# EAGLE design v1 (EAGLE 9.6.2)
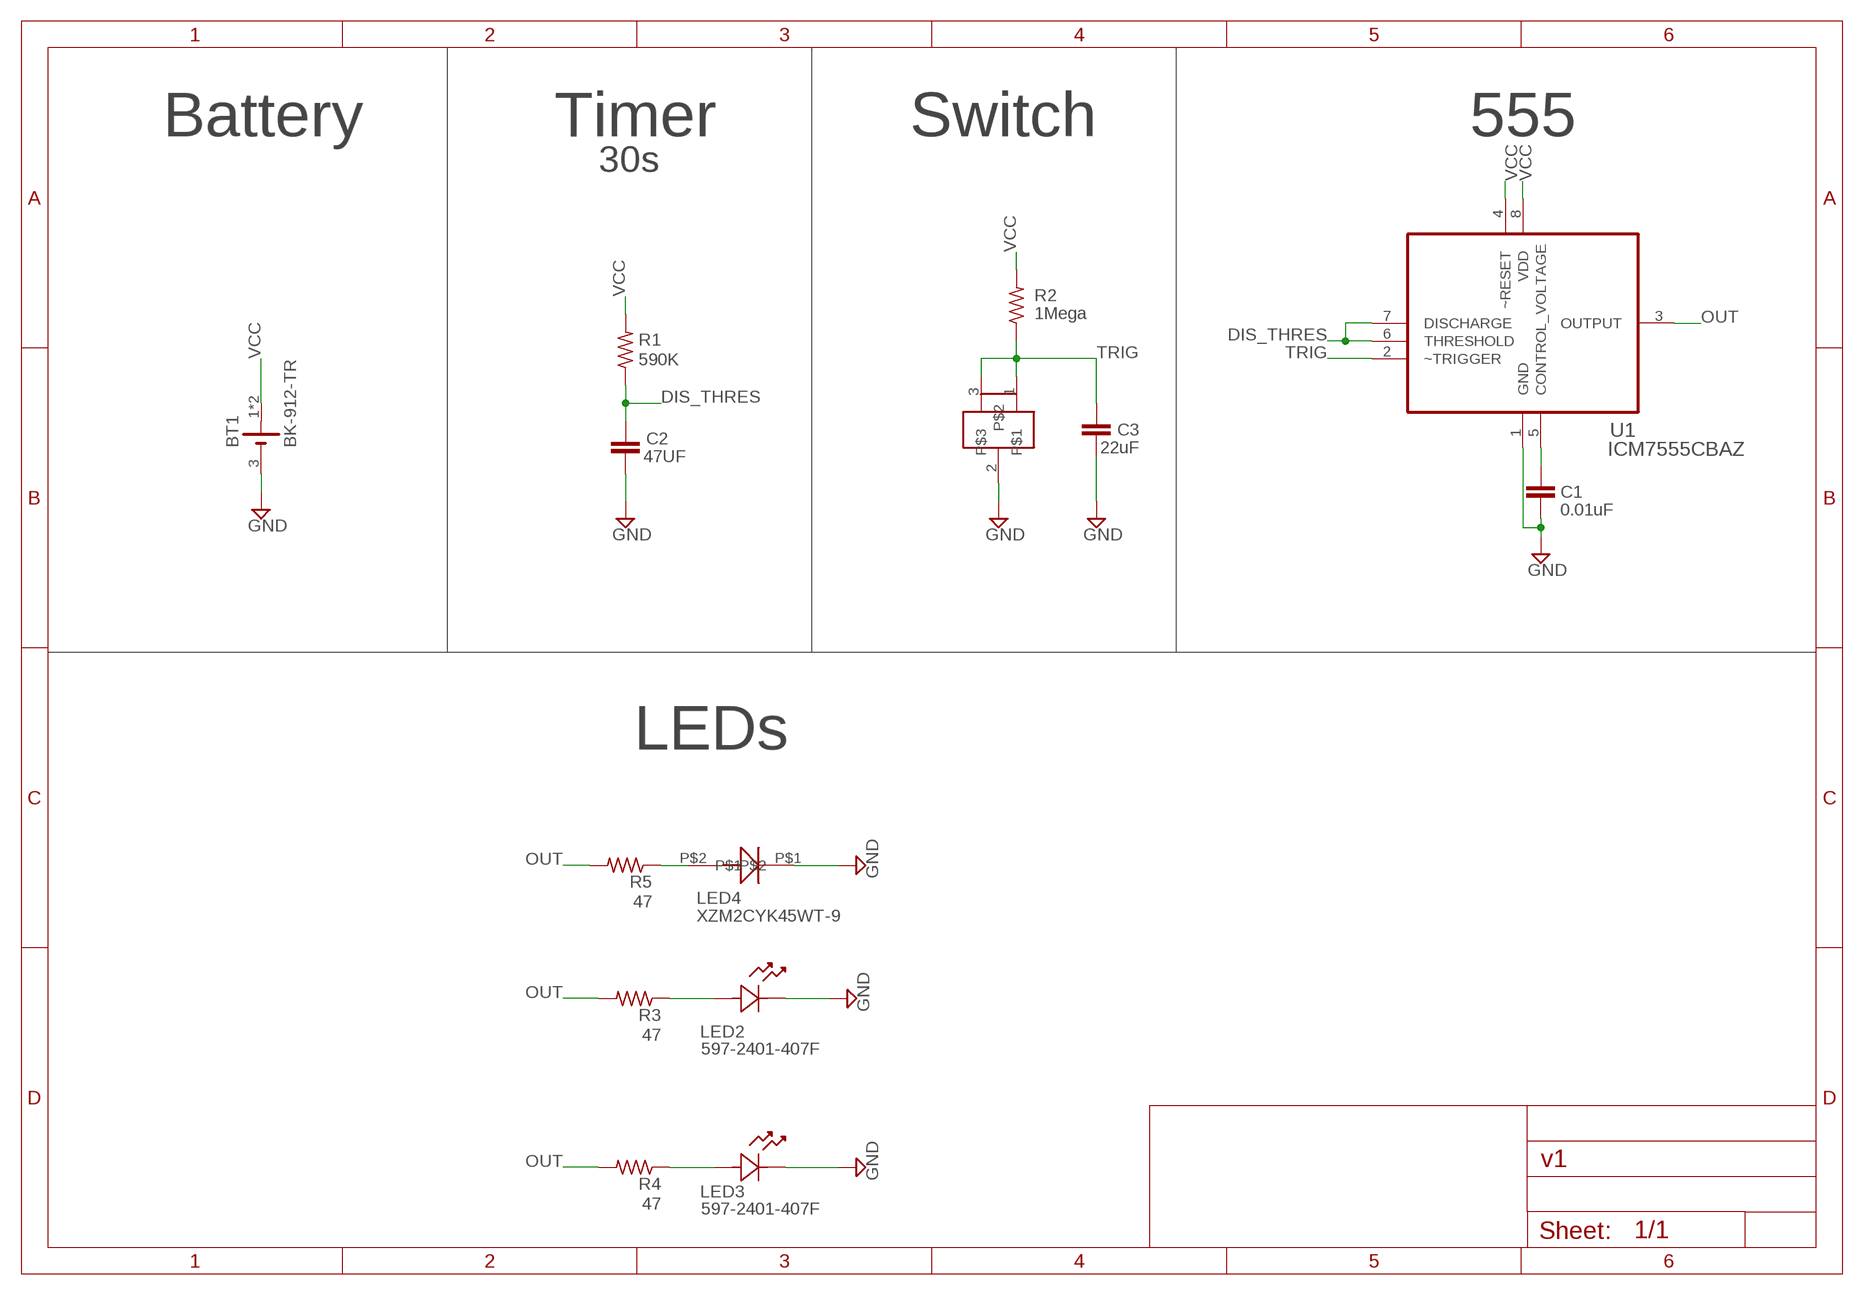
[diagram p0: schematic, sheet 1]

## Parts
BT1  BK-912-TR  [MPD_BK-912-TR]
C1  0.01uF  C-EUC0603  [C0603]
C2  47UF  C-EUC0603  [C0603]
C3  22uF  C-EUC0603  [C0603]
LED2  597-2401-407F  [LED_597-2401-407F]
LED3  597-2401-407F  [LED_597-2401-407F]
LED4  XZM2CYK45WT-9  [XZM2CYK45WT]
R1  590K  R-US_R0603  [R0603]
R2  1Mega  R-US_R0603  [R0603]
R3  47  R-US_R0603  [R0603]
R4  47  R-US_R0603  [R0603]
R5  47  R-US_R0603  [R0603]
SW1  TM1000Q  [SIP750W46P254L1400H1010Q3]
U1  ICM7555CBAZ  [SOIC127P600X175-8N]

## Nets
DIS_THRES: C2.2 R1.1 U1.6(THRESHOLD) U1.7(DISCHARGE)
GND: BT1.3(-) C1.1 C2.1 C3.1 LED2.1 LED3.1 LED4.P$1 SW1.2 U1.1(GND)
N$1: C1.2 U1.5(CONTROL_VOLTAGE)
N$2: LED2.2 R3.1
N$3: LED3.2 R4.1
N$4: LED4.P$2 R5.1
OUT: R3.2 R4.2 R5.2 U1.3(OUTPUT)
TRIG: C3.2 R2.1 SW1.1 SW1.3 U1.2(~TRIGGER)
VCC: BT1.1(+) BT1.2(+) R1.2 R2.2 U1.4(~RESET) U1.8(VDD)

## Notes on the sheet
- Battery | Timer | Switch | 555
- 30s
- LEDs

## Library data of the parts
BT1 = BK-912-TR:BK-912-TR: Holder Coin Cell 20mm Smd Check availability <https://pricing.snapeda.com/parts/BK-912-TR/MPD%20%28Memory/view-part?ref=eda>; AVAILABILITY: In Stock; DESCRIPTION: Battery Retainer Coin, 20.0mm 1 Cell SMD (SMT) Tab; DK_PN: BK-912-TR-ND; MF: MPD (Memory; MP: BK-912-TR; PACKAGE: None; PRICE: None; PURCHASE-URL: https://pricing.snapeda.com/search/part/BK-912-TR/?ref=eda
C1 = rcl:C-EU: CAPACITOR, European symbol; DK_PN: 1292-1384-1-ND; SPICEPREFIX: C
C2 = rcl:C-EU: CAPACITOR, European symbol; DK_PN: 1276-CL10A476MQ8QRNCCT-ND; SPICEPREFIX: C
C3 = rcl:C-EU: CAPACITOR, European symbol; DK_PN: 1276-2868-1-ND; MF: Samsung; MP: CL10A226MQ8NRNE; SPICEPREFIX: C
LED2 LED3 = 597-2401-407F:597-2401-407F: LED RIGHT ANGLE Yellow SMD 1208 Check availability <https://pricing.snapeda.com/parts/597-2401-407F/Dialight/view-part?ref=eda>; AVAILABILITY: In Stock; DESCRIPTION: Yellow - LED Indication - Discrete 2.2V 2-SMD, No Lead; DK_PN: 350-2944-1-ND; MF: Dialight; MP: 597-2401-407F; PACKAGE: SMD-2 Dialight; PRICE: None; PURCHASE-URL: https://pricing.snapeda.com/search/part/597-2401-407F/?ref=eda
LED4 = XZM2CYK45WT:XZM2CYK45WT-9: XZM2CYK45WT SunLED Reverse Mount - Datasheet <https://www.sunledusa.com/products/spec/XZM2CYK45WT-9.pdf>; DK_PN: 1497-1335-2-ND
R1 = rcl:R-US_: RESISTOR, American symbol; DK_PN: 311-590KHRCT-ND; SPICEPREFIX: R
R2 = rcl:R-US_: RESISTOR, American symbol; DK_PN: RMCF0603FG1M00CT-ND; SPICEPREFIX: R
R3-R5 = rcl:R-US_: RESISTOR, American symbol; DK_PN: 311-47.0HRCT-ND; MF: YAGEO; PN: RC0603FR-0747RL; SPICEPREFIX: R
SW1 = SIP750W46P254L1400H1010Q3:TM1000Q: TM1000 - Datasheet <https://sten-eswitch-13110800-production.s3.amazonaws.com/system/asset/product_line/data_sheet/128/TM1000.pdf>; DK_PN: EG4917CT-ND
U1 = ICM7555CBAZ:ICM7555CBAZ: CMOS RC timers Check availability <https://pricing.snapeda.com/parts/ICM7555CBAZ/Renesas%20Electronics/view-part?ref=eda>; AVAILABILITY: In Stock; DESCRIPTION: 555 Type, Timer/Oscillator (Single) IC 1MHz 8-SOIC; DK_PN: ICM7555CBAZ-ND; MF: Renesas Electronics; MP: ICM7555CBAZ; PACKAGE: SOIC-8 Intersil; PRICE: None; PURCHASE-URL: https://pricing.snapeda.com/search/part/ICM7555CBAZ/?ref=eda

## Board
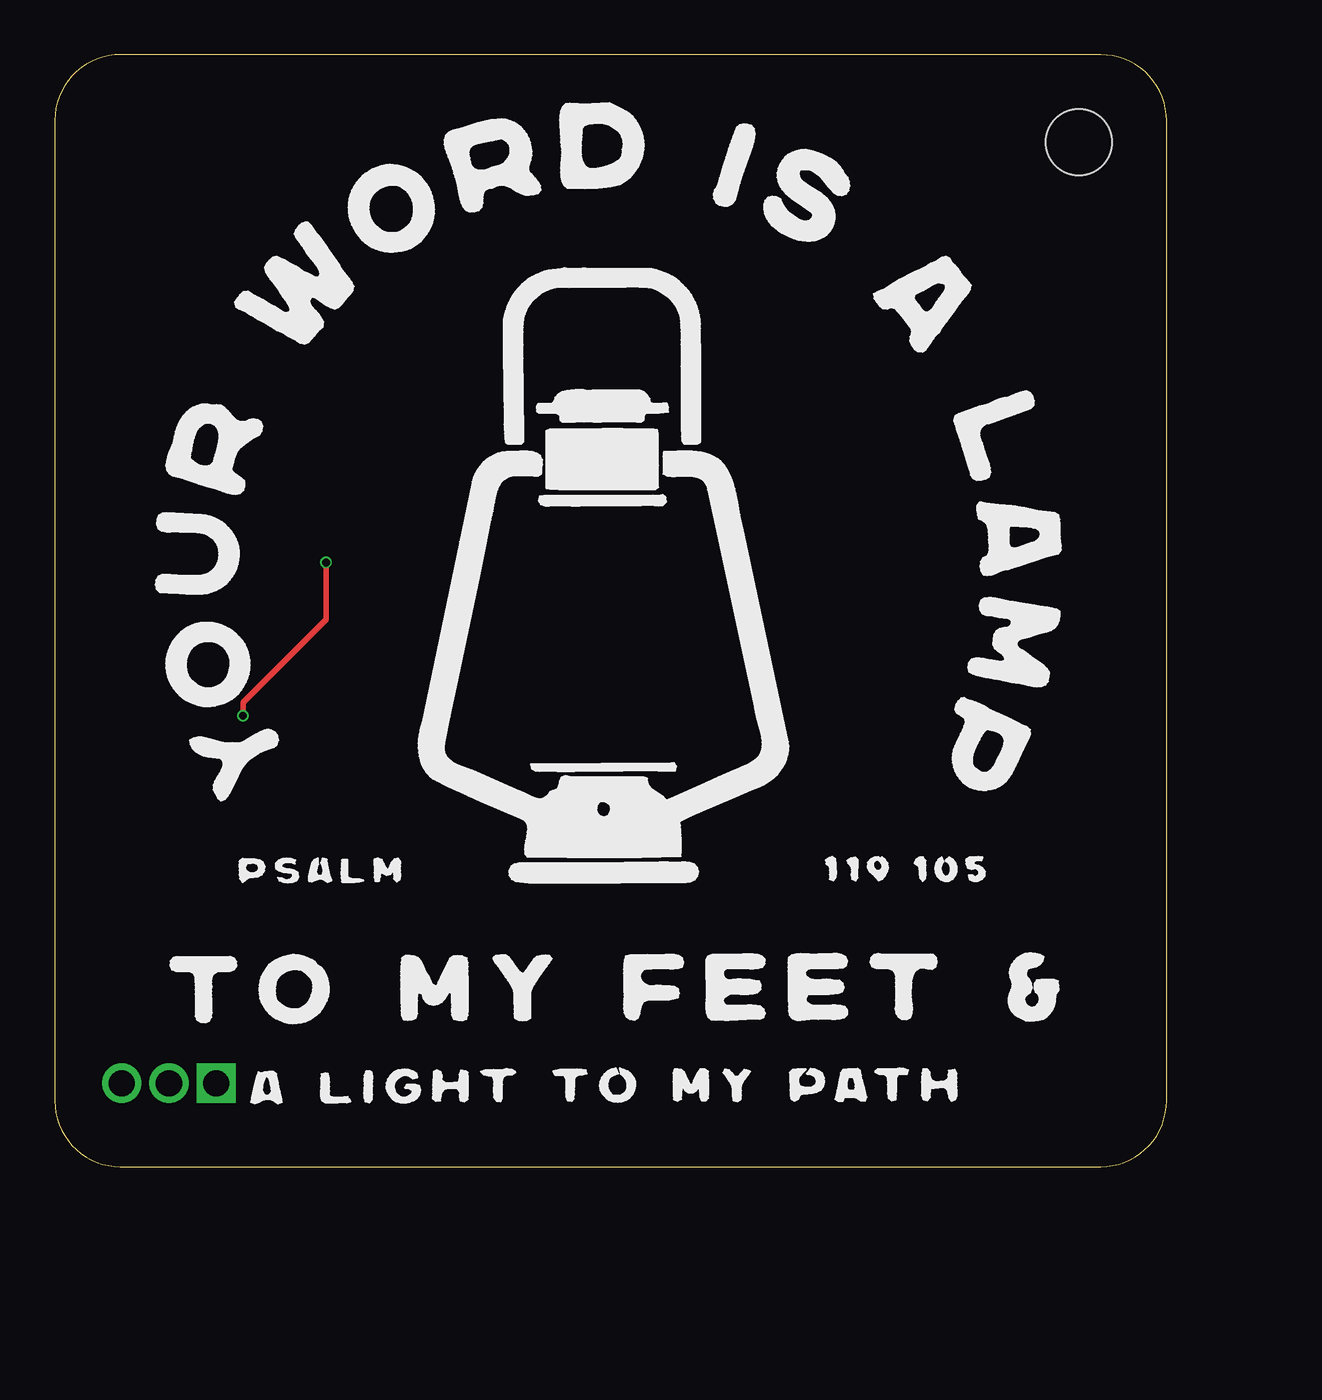
[diagram p1: board, top side]
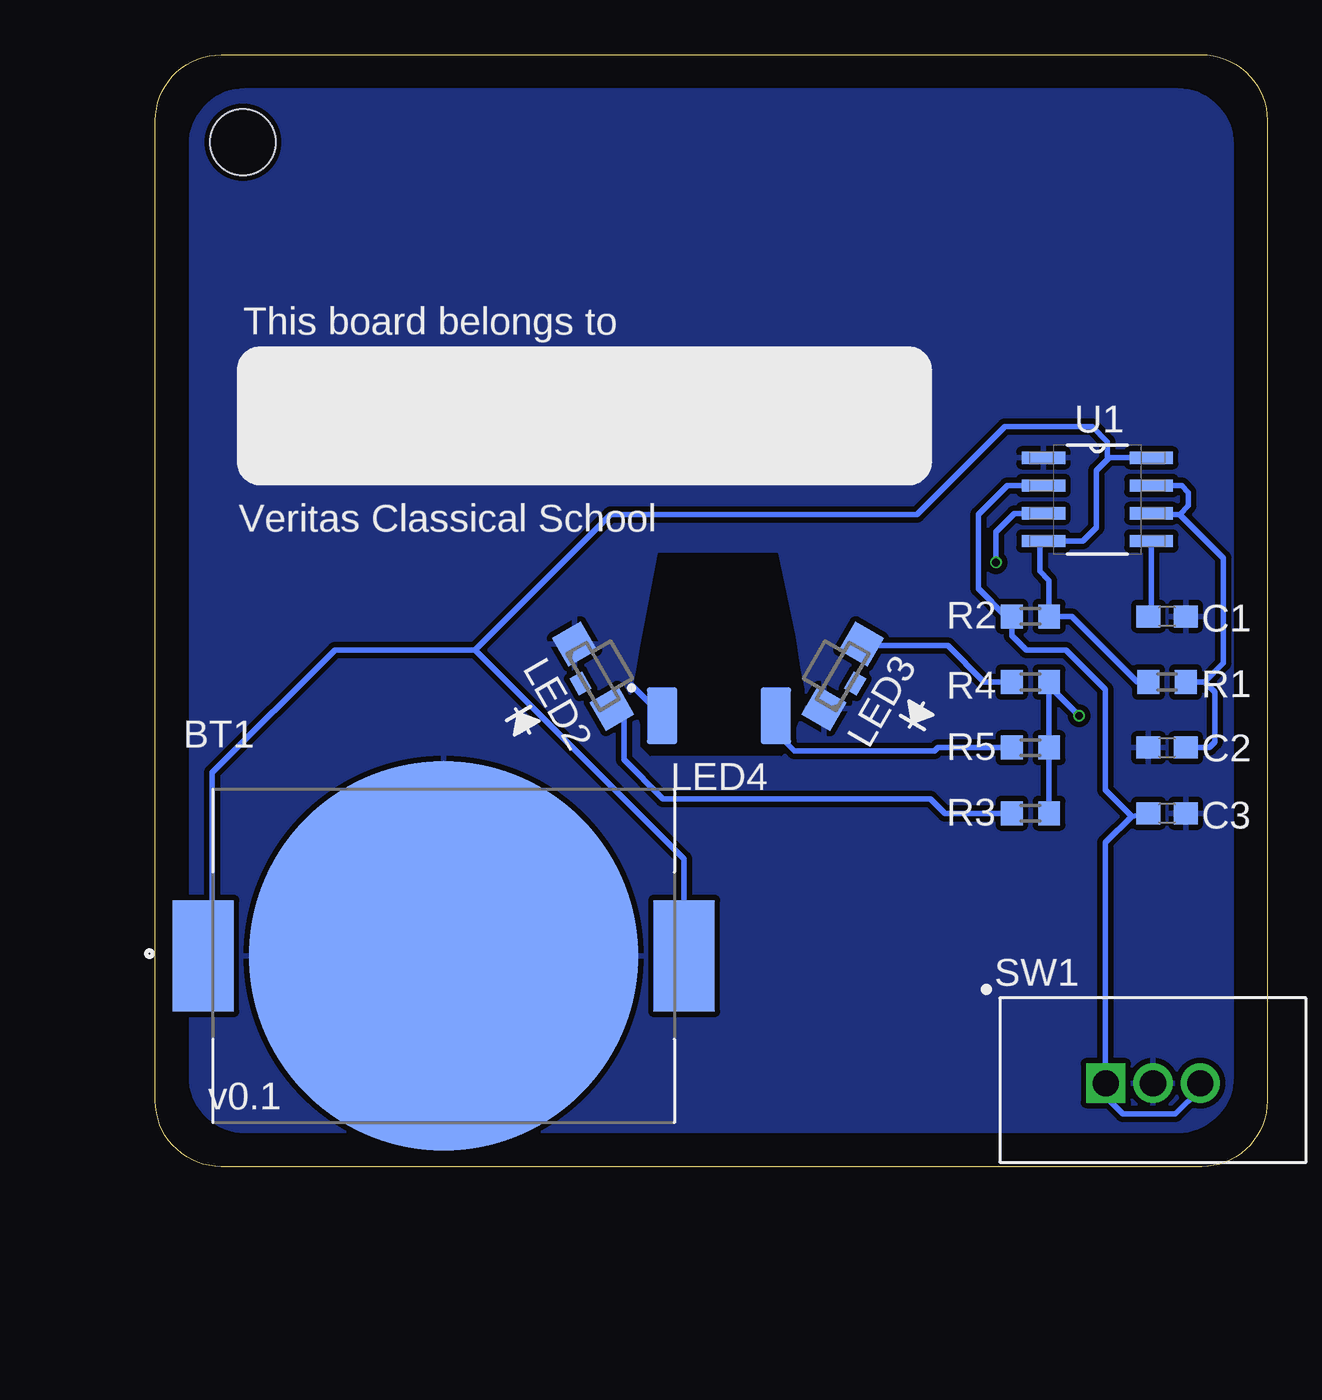
[diagram p2: board, bottom side, seen from below]

Size 50.8 x 50.8 mm. Coordinates in mm from the lower left corner, seen from the top.
Outline: 0,47.8 0,3 arc90 3,0 47.8,0 48.06,0.01 arc85 50.8,3 50.8,47.8 50.79,48.06 arc85 47.8,50.8 3,50.8 2.74,50.79 arc85 0,47.8
Copper layers (1*16): Top 0.035559375mm / dielectric 1.6mm / Bottom 0.035559375mm
Design rules "jlcpcb2layer": minimum track width 5mil, minimum drill 12mil, track to track 5mil, track to pad 5mil, pad to pad 5mil, via to via 5mil, smd to smd 5mil, copper to edge 8mil, drill to drill 6mil, minimum pad ring 5mil, minimum via ring 3mil, stop-mask expansion 2.5mil, vias tented up to drill 0mil, thermal gap 10mil
Holes 3 mm at 46.8,46.8

### Footprints (pad centres in the part's own frame; a part is rotated, then mirrored left to right if it is on the bottom)
MPD_BK-912-TR = smd 2.79 x 5.08: 1 -10.985,0; 2 10.985,0 | smd 17.78 x 17.78: 3 0,0
C0603 = smd 1.1 x 1: 1 -0.85,0; 2 0.85,0
LED_597-2401-407F = smd 1.499 x 1.499: 1 0,1.702; 2 0,-1.702 | smd 0.66 x 0.889: 3 -0.66,0
XZM2CYK45WT = smd 1.4 x 2.6: P$1 -2.6,0; P$2 2.6,0
R0603 = smd 1 x 1.1: 1 -0.85,0; 2 0.85,0
SIP750W46P254L1400H1010Q3 = drill 1.194 square: 1 0.381,0 | drill 1.194: 2 2.54,0; 3 4.699,0
SOIC127P600X175-8N = smd 1.981 x 0.559: 1 -2.464,1.905; 2 -2.464,0.635; 3 -2.464,-0.635; 4 -2.464,-1.905; 5 2.464,-1.905; 6 2.464,-0.635; 7 2.464,0.635; 8 2.464,1.905

### Placement (x,y rotation side)
BT1  37.63,9.63 0 bottom
C1  4.58,25.14 180 bottom
C2  4.58,19.14 0 bottom
C3  4.58,16.14 180 bottom
LED2  30.8,22.4 30 bottom
LED3  19.4,22.4 150 bottom
LED4  25.05,20.6 0 bottom
R1  4.58,22.14 180 bottom
R2  10.82,25.14 0 bottom
R3  10.82,16.14 0 bottom
R4  10.82,22.14 0 bottom
R5  10.82,19.14 0 bottom
SW1  7.76,3.81 0 bottom
U1  7.76,30.48 0 bottom

### Tracks (layer width: path | path; a pad name or v marks a point on that pad's centre or on a via)
DIS_THRES
  Bottom 0.254: U1.7 3.92,31.11 3.6,30.8 3.6,30.2 4,29.8 | 4,29.8 5.25,29.8 U1.6 | 4,29.8 2,27.8 2,23 2.86,22.14 | R1.1 2.86,22.14 | C2.2 2.66,19.14 2.4,19.4 2.4,21.68 2.86,22.14
GND
  Bottom 0.254: LED4.P$1 29.05,22
  pour Bottom (isolate 0.254, rank 2): 1.6,46.7 1.6,4.1 arc90 4.1,1.6 46.7,1.6 arc90 49.2,4.1 49.2,46.7 arc90 46.7,49.2 4.1,49.2 arc90
N$1
  Bottom 0.254: U1.5 5.3,25.27 C1.2
N$2
  Bottom 0.254: LED2.2 29.4,20.38 29.4,18.6 27.6,16.8 15.4,16.8 14.74,16.14 R3.1
N$3
  Bottom 0.254: LED3.2 18.15,23.8 14.6,23.8 12.94,22.14 R4.1
N$4
  Bottom 0.254: LED4.P$2 22.45,19.85 21.6,19 15.2,19 15.06,19.14 R5.1
N$5
  cutout Bottom: 22.4,28 21.6,24.2 21.4,22.8 21.2,21.8 21.2,21 21.6,20 21.6,19.4 22.2,18.8 28.2,18.8 28.6,19.2 28.6,20.2 28.8,20.8 29,21.6 28.8,22.6 28.6,23.8 27.8,28
OUT  (via drill 0.35)
  Top 0.254: v12.4,27.6 12.4,25 8.6,21.2 v8.6,20.6
  Bottom 0.254: U1.3 11.55,29.84 12.4,29 v12.4,27.6 | R3.2 R5.2 R4.2 10.14,22.14 v8.6,20.6
TRIG
  Bottom 0.254: U1.2 11.88,31.11 13.2,29.8 13.2,26.4 11.94,25.14 R2.1 11.67,24.27 11,23.6 9.2,23.6 7.4,21.8 7.4,17.2 6.2,16 | 7.4,3.83 SW1.1 | SW1.3 3.06,3.54 4.2,2.4 6.6,2.4 7.4,3.2 7.4,3.83 | C3.2 6.2,16 | 6.2,16 7.4,14.8 7.4,3.83
VCC
  Bottom 0.254: BT1.2 26.64,14.04 36.2,23.6 | 36.2,23.6 30,29.8 16,29.8 12,33.8 8,33.8 7.3,33.1 7.3,32.3 | BT1.1 48.2,10.04 48.2,18 42.6,23.6 36.2,23.6 | U1.8 7.21,32.38 7.3,32.3 | 7.3,32.3 7.8,31.8 7.8,29.2 8.43,28.57 U1.4 10.4,28.4 10.4,27.2 9.97,26.77 R2.2 8.94,25.14 5.94,22.14 R1.2

### Text on the board
bNames: This board belongs to | Veritas Classical School | v0.1